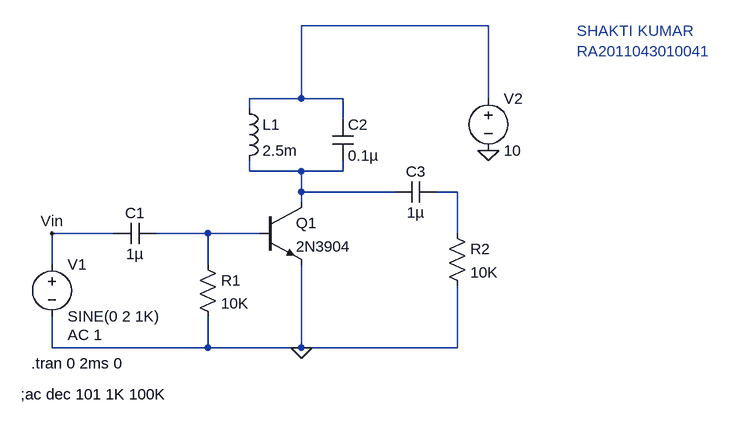
[diagram p0: schematic exp_5.1.asc]
exp_5.1.asc, the LTspice schematic file:
Version 4
SHEET 1 880 680
WIRE 16 -80 -272 -80
WIRE -272 32 -272 -80
WIRE -272 32 -352 32
WIRE -208 32 -272 32
WIRE 16 32 16 -80
WIRE -352 48 -352 32
WIRE -208 64 -208 32
WIRE -352 144 -352 128
WIRE -272 144 -352 144
WIRE -208 144 -208 128
WIRE -208 144 -272 144
WIRE -272 176 -272 144
WIRE -128 176 -272 176
WIRE -32 176 -64 176
WIRE -272 192 -272 176
WIRE -560 240 -656 240
WIRE -416 240 -496 240
WIRE -336 240 -416 240
WIRE -32 240 -32 176
WIRE -656 288 -656 240
WIRE -416 288 -416 240
WIRE -656 416 -656 368
WIRE -416 416 -416 368
WIRE -416 416 -656 416
WIRE -272 416 -272 288
WIRE -272 416 -416 416
WIRE -32 416 -32 320
WIRE -32 416 -272 416
FLAG 16 112 0
FLAG -272 416 0
FLAG -656 240 Vin
SYMBOL voltage -656 272 R0
WINDOW 123 24 124 Left 2
WINDOW 39 0 0 Left 0
SYMATTR Value2 AC 1
SYMATTR InstName V1
SYMATTR Value SINE(0 2 1K)
SYMBOL cap -496 224 R90
WINDOW 0 0 32 VBottom 2
WINDOW 3 32 32 VTop 2
SYMATTR InstName C1
SYMATTR Value 1µ
SYMBOL res -432 272 R0
SYMATTR InstName R1
SYMATTR Value 10K
SYMBOL npn -336 192 R0
SYMATTR InstName Q1
SYMATTR Value 2N3904
SYMBOL ind -368 32 R0
SYMATTR InstName L1
SYMATTR Value 2.5m
SYMBOL cap -224 64 R0
SYMATTR InstName C2
SYMATTR Value 0.1µ
SYMBOL cap -64 160 R90
WINDOW 0 0 32 VBottom 2
WINDOW 3 32 32 VTop 2
SYMATTR InstName C3
SYMATTR Value 1µ
SYMBOL voltage 16 16 R0
SYMATTR InstName V2
SYMATTR Value 10
SYMBOL res -48 224 R0
SYMATTR InstName R2
SYMATTR Value 10K
TEXT -688 440 Left 2 !.tran 0 2ms 0
TEXT 152 -72 Left 2 ;SHAKTI KUMAR\nRA2011043010041
TEXT -704 488 Left 2 !;ac dec 101 1K 100K

The netlist it stands for:
* exp_5.1.asc
V1 Vin 0 SINE(0 2 1K) AC 1
C1 N004 Vin 1µ
R1 N004 0 10K
Q1 N002 N004 0 0 2N3904
L1 N001 N002 2.5m
C2 N001 N002 0.1µ
C3 N003 N002 1µ
V2 N001 0 10
R2 N003 0 10K
.model NPN NPN
.model PNP PNP
.lib standard.bjt
.tran 0 2ms 0
* SHAKTI KUMAR
* RA2011043010041
;ac dec 101 1K 100K
.backanno
.end